# EAGLE design controlador (EAGLE 7.6.0)
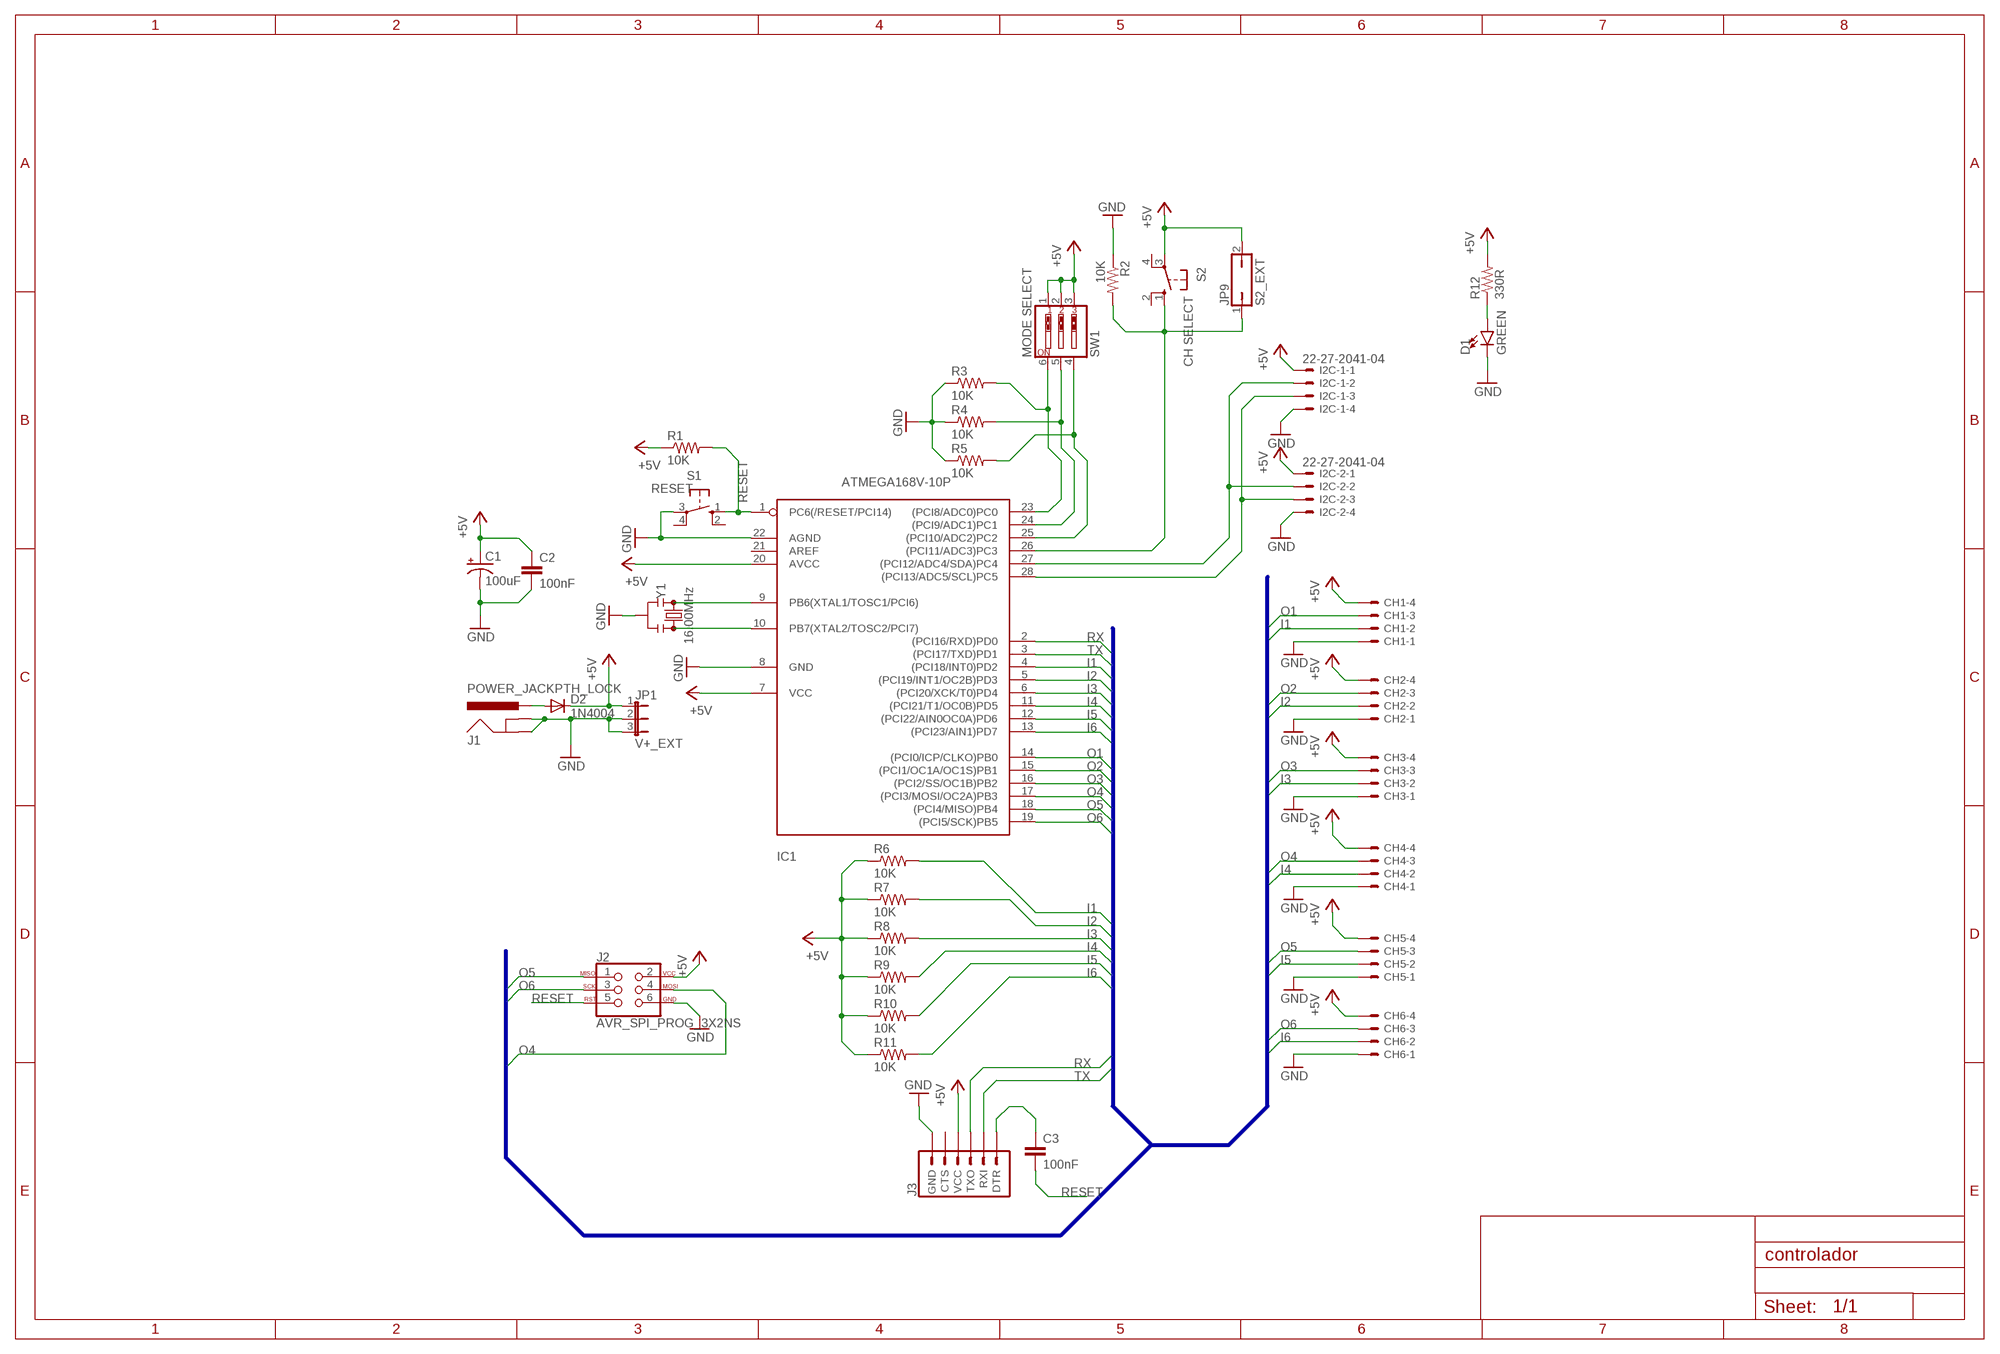
[diagram p0: schematic, sheet 1]

## Parts
C1  100uF  CPOL-USE2.5-7  [E2,5-7]
C2  100nF  C-EU075-032X103  [C075-032X103]
C3  100nF  C-EU075-032X103  [C075-032X103]
CH1  22-27-2041-04  [6410-04]
CH2  22-27-2041-04  [6410-04]
CH3  22-27-2041-04  [6410-04]
CH4  22-27-2041-04  [6410-04]
CH5  22-27-2041-04  [6410-04]
CH6  22-27-2041-04  [6410-04]
D1  GREEN  LED5MM  [LED_5MM]
D2  1N4004  [DO41-10]
I2C-1  22-27-2041-04  [6410-04]
I2C-2  22-27-2041-04  [6410-04]
IC1  ATMEGA168V-10P  [DIL28-3]
J1  POWER_JACKPTH_LOCK  [POWER_JACK_PTH_LOCK]
J2  AVR_SPI_PROG_3X2NS  [2X3-NS]
J3  6_PIN_SERIAL_TARGETSILK  [6_PIN_SERIAL_TARGET_SIDE_W_SILK]
JP1  V+_EXT  JP2E  [JP2]
JP9  S2_EXT  JP1Q  [JP1]
R1  10K  R-US_0204/7  [0204/7]
R2  10K  R-US_0204/7  [0204/7]
R3  10K  R-US_0204/7  [0204/7]
R4  10K  R-US_0204/7  [0204/7]
R5  10K  R-US_0204/7  [0204/7]
R6  10K  R-US_0204/7  [0204/7]
R7  10K  R-US_0204/7  [0204/7]
R8  10K  R-US_0204/7  [0204/7]
R9  10K  R-US_0204/7  [0204/7]
R10  10K  R-US_0204/7  [0204/7]
R11  10K  R-US_0204/7  [0204/7]
R12  330R  R-US_0204/7  [0204/7]
S1  RESET  10-XX  [B3F-10XX]
S2  CH SELECT  10-XX  [B3F-10XX]
SW1  MODE SELECT  SW_DIP-3  [EDG-03]
Y1  16.00MHz  RESONATORPTH-7.6X3.8  [RESONATOR-PTH-7.6X3.8]

## Nets
+5V [power]: C1.+ C2.1 CH1.4 CH2.4 CH3.4 CH4.4 CH5.4 CH6.4 D2.C I2C-1.1 I2C-2.1 IC1.7(VCC) IC1.20(AVCC) J2.2 J3.P$4(VCC) JP1.1 JP9.2 R1.1 R6.1 R7.1 R8.1 R9.1 R10.1 R11.1 R12.2 S2.3(P) SW1.1 SW1.2 SW1.3
GND: C1.- C2.2 CH1.1 CH2.1 CH3.1 CH4.1 CH5.1 CH6.1 D1.K(C) I2C-1.4 I2C-2.4 IC1.8(GND) IC1.22(AGND) J1.GND J1.GNDBREAK J2.6 J3.P$6(GND) JP1.2 JP1.3 R2.1 R3.1 R4.1 R5.1 S1.3(P) Y1.2
I1: CH1.2 IC1.4((PCI18/INT0)PD2) R6.2
I2: CH2.2 IC1.5((PCI19/INT1/OC2B)PD3) R7.2
I3: CH3.2 IC1.6((PCI20/XCK/T0)PD4) R8.2
I4: CH4.2 IC1.11((PCI21/T1/OC0B)PD5) R9.2
I5: CH5.2 IC1.12((PCI22/AIN0OC0A)PD6) R10.2
I6: CH6.2 IC1.13((PCI23/AIN1)PD7) R11.2
N$1: IC1.9(PB6(XTAL1/TOSC1/PCI6)) Y1.1
N$2: IC1.10(PB7(XTAL2/TOSC2/PCI7)) Y1.3
N$3: D1.A R12.1
N$4: I2C-1.2 I2C-2.2 IC1.27((PCI12/ADC4/SDA)PC4)
N$5: I2C-1.3 I2C-2.3 IC1.28((PCI13/ADC5/SCL)PC5)
N$6: IC1.26((PCI11/ADC3)PC3) JP9.1 R2.2 S2.1(S)
N$7: C3.1 J3.P$1(DTR)
N$8: D2.A J1.PWR
N$10: IC1.23((PCI8/ADC0)PC0) R3.2 SW1.6
N$11: IC1.24((PCI9/ADC1)PC1) R4.2 SW1.5
N$12: IC1.25((PCI10/ADC2)PC2) R5.2 SW1.4
O1: CH1.3 IC1.14((PCI0/ICP/CLKO)PB0)
O2: CH2.3 IC1.15((PCI1/OC1A/OC1S)PB1)
O3: CH3.3 IC1.16((PCI2/SS/OC1B)PB2)
O4: CH4.3 IC1.17((PCI3/MOSI/OC2A)PB3) J2.4
O5: CH5.3 IC1.18((PCI4/MISO)PB4) J2.1
O6: CH6.3 IC1.19((PCI5/SCK)PB5) J2.3
RESET: C3.2 IC1.1(PC6(/RESET/PCI14)) J2.5 R1.2 S1.1(S)
RX: IC1.2((PCI16/RXD)PD0) J3.P$2(TXO)
TX: IC1.3((PCI17/TXD)PD1) J3.P$3(RXI)
Unconnected: IC1.21(AREF) J3.P$5(CTS) S1.2(S1) S1.4(P1) S2.2(S1) S2.4(P1)

## Buses
B$1

## Library data of the parts
C1 = rcl:CPOL-US: POLARIZED CAPACITOR, American symbol
C2 C3 = rcl:C-EU: CAPACITOR, European symbol
CH1-CH6 I2C-1 I2C-2 = con-molex:22-?-04: CONNECTOR wire to board 2.54 mm (.1 inch) pitch header; OC_FARNELL: unknown; OC_NEWARK: unknown
D1 = SparkFun-LED:LED: LED (Generic) Standard schematic elements and footprints for 5mm, 3mm, 1206, and 0603 sized LEDs. Generic LEDs with no color specified.
D2 = diode:1N4004: DIODE general purpose rectifier, 1 A
IC1 = adafruit:ATMEGA168*P: MICROCONTROLLER 16 kBytes FLASH 1 kBytes SRAM 512 Bytes EEPROM USART 8-channel 10 bit ADC
J1 = SparkFun-Connectors:POWER_JACK: Power Jack Connector This is the standard 5.5mm barrel jack for power. The PTH is the most common, proven, reliable, footprint. The Slot footprint only works if the mill layer is transmitted to the PCB fab house so be warned. Here are the connectors we sell at SparkFun: DC Barrel Power Jack/Connector <https://www.sparkfun.com/products/119> (PRT-00119) DC Barrel Power Jack/Connector (SMD) <https://www.sparkfun.com/products/12748> (PRT-12748) DC Barrel Jack Adapter - Breadboard Compatible <https://www.sparkfun.com/products/10811> (PRT-10811) It is used on this SparkFun product (and many, many others): SparkFun RedBoard - Programmed with Arduino <https://www.sparkfun.com/products/12757> (DEV-12757) Also, if you need a mating power supply or connector, please check these out: Wall Adapter Power Supply - 9VDC 650mA <https://www.sparkfun.com/products/298> (TOL-00298) DC Barrel Jack Adapter - Male <https://www.sparkfun.com/products/10287> (PRT-10287); PROD_ID: CONN-08197; SF_ID: PRT-00119
J2 = SparkFun-Connectors:AVR_SPI_PROG_3X2: AVR ISP 6 Pin This is the reduced ISP connector for AVR programming. Common on Arduino. This footprint will take up less PCB space and can be used with a 10-pin to 6-pin adapter such as SKU: BOB-08508 **Special note about "TEST_POINT" package. The stop mask is on the top side, so if you want your programming test points to be on the bottom of your board, make sure to place this package on the bottom side of the board. This also ensure that the orientation to program from the bottom side will be correct. SparkFun Products: SparkFun ISP Pogo Adapter <https://www.sparkfun.com/products/11591> - NS Tiny AVR Programmer <https://www.sparkfun.com/products/11801> -PTH
J3 = SparkFun-Connectors:6_PIN_SERIAL_TARGET: 6-pin header connection for use with the "FTDI BASIC" pinout - TARGET SIDE. Also known as "Arduino Serial Program Header". It is used to mate with our FTDI Basic serial programmers using the Arduino IDE. Note, this device has "TARGET" in the name. It is intended to be used on a design that contains a target micro-controller that you wish to program. The "sister" device, named "CABLE" is inteneded to be used on a design that usually lives on the end of your USB cable and prvides the converter chip (FTDI232 or FTDI231x) to commnicate serial RX/TX. You can populate with some of these: Break Away Headers - Straight <https://www.sparkfun.com/products/116> (PRT-00116) For reference (or to suit your programming needs) check out these designs: SparkFun FTDI Basic Breakout - 5V <https://www.sparkfun.com/products/9716> (DEV-09716) SparkFun FTDI Basic Breakout - 3.3V <https://www.sparkfun.com/products/9873> (DEV-09873) SparkFun FTDI SmartBasic <https://www.sparkfun.com/products/12935> (DEV-12935) SparkFun Beefy 3 - FTDI Basic Breakout <https://www.sparkfun.com/products/13746> (DEV-13746)
JP1 = jumper:JP2E: JUMPER
JP9 = jumper:JP1Q: JUMPER
R1-R11 = rcl:R-US_: RESISTOR, American symbol
R12 = resistor:R-US_: RESISTOR, American symbol
S1 S2 = switch-omron:10-XX: OMRON SWITCH; MPN: B3F-1000; OC_FARNELL: 176432; OC_NEWARK: 36M3542
SW1 = special:SW_DIP-3: DIP SWITCH
Y1 = SparkFun-Clocks:RESONATOR: Resonators (Generic) Ceramic resonators are clock-generating components, often used to control timing in microcontrollers. They usually have 3 pins: two pins for oscillation, and one pin for ground. Compared to crystals, resonators have worse tolerance, but are usually much cheaper. Plus, they have built-in load capacitors! These devices are used on boards like the Arduino Pro 8MHz <https://www.sparkfun.com/products/11114> and Arduino Pro 16MHz <https://www.sparkfun.com/products/11113>.

## Net classes
0 default: width 0.5 mm
1 power: width 0.65 mm

## Board
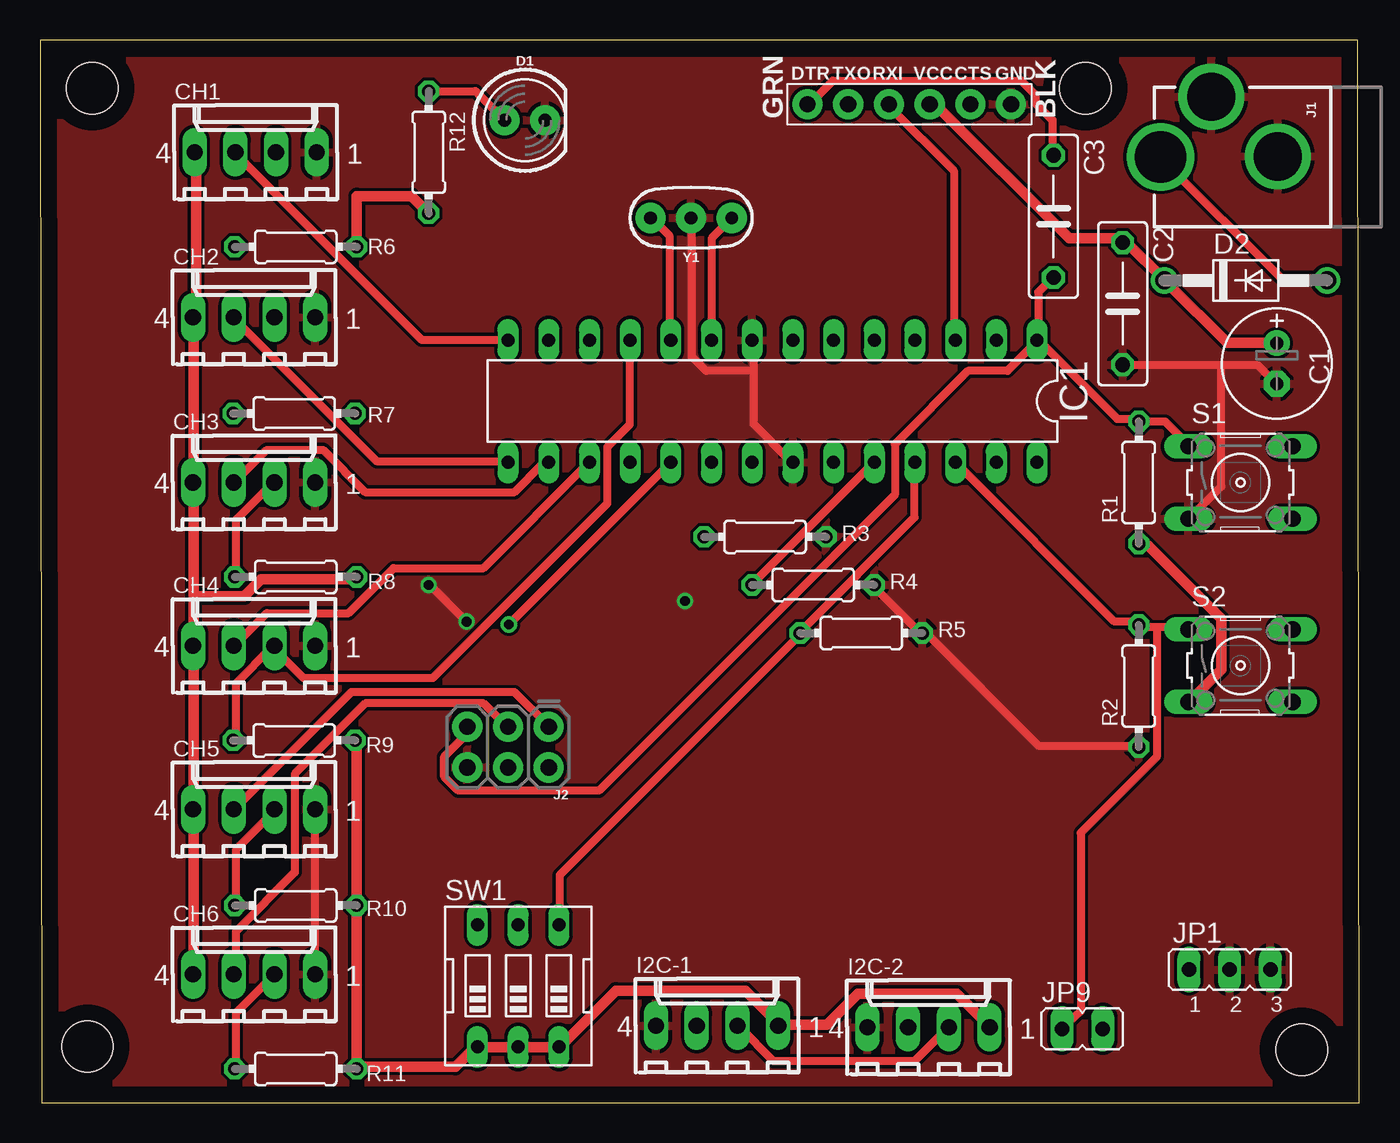
[diagram p1: board, top side]
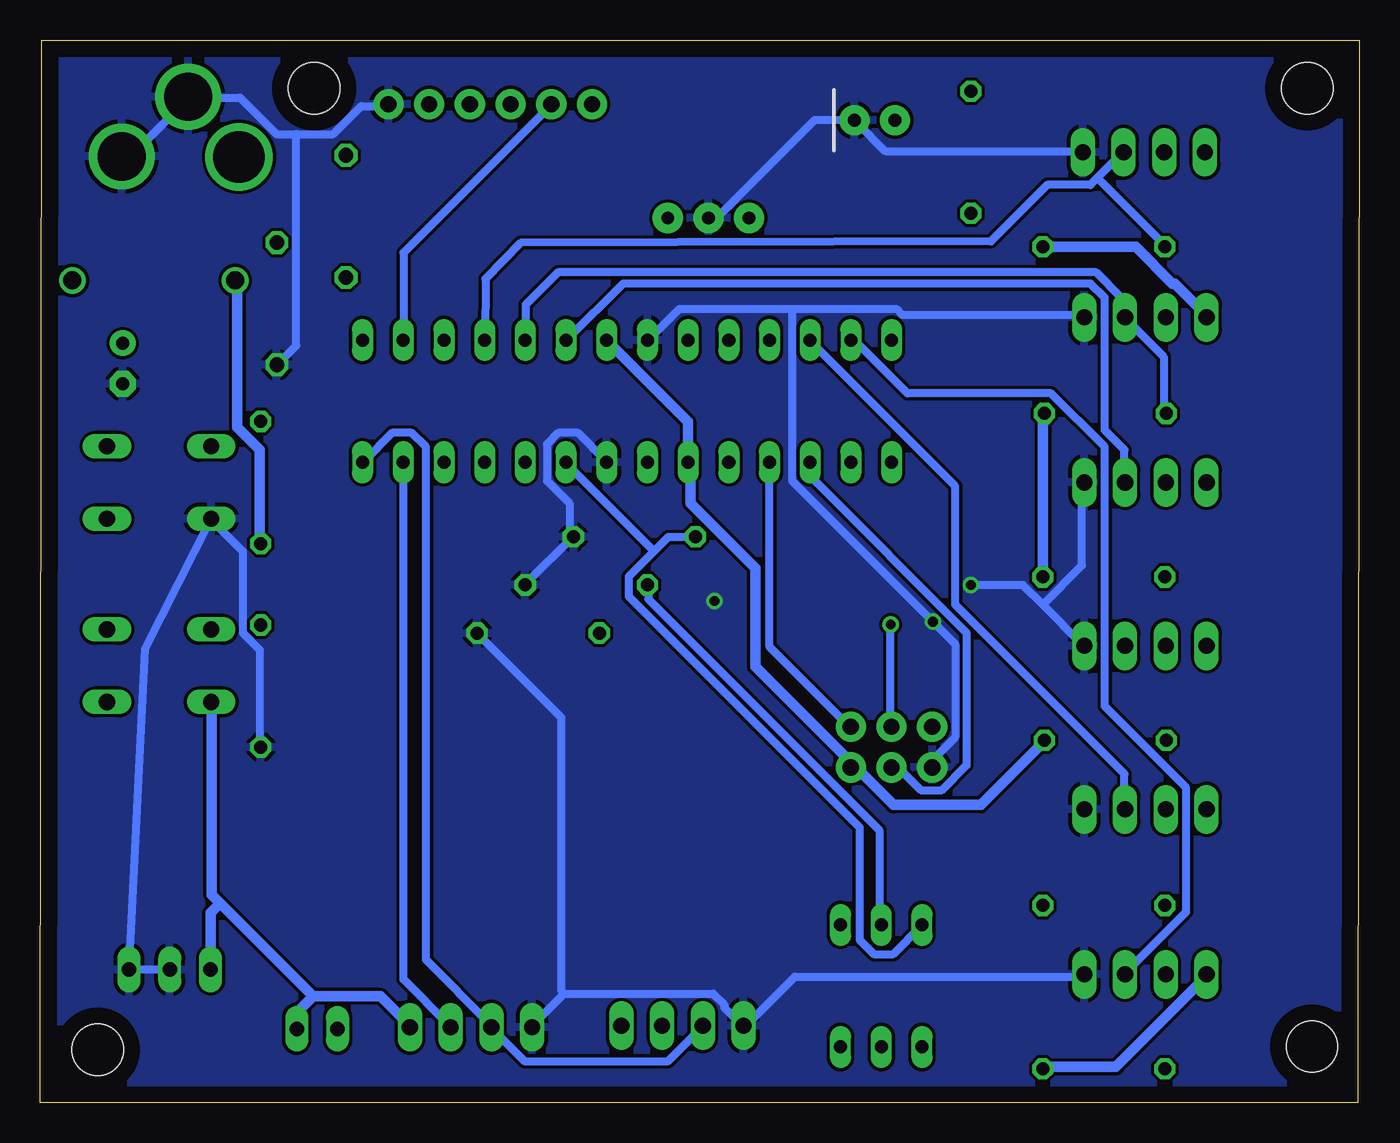
[diagram p2: board, bottom side, seen from below]

Size 82.36 x 66.3 mm. Coordinates in mm from the lower left corner, seen from the top.
Outline: 0.1,0 82.36,0 82.26,66.3 0,66.3 0.1,0
Copper layers (1*16): Top 0.035mm / dielectric 1.5mm / Bottom 0.035mm
Design rules "default": minimum track width 10mil, minimum drill 24mil, track to track 8mil, track to pad 8mil, pad to pad 8mil, via to via 8mil, smd to smd 8mil, copper to edge 40mil, drill to drill 8mil, minimum pad ring 10mil, minimum via ring 8mil, stop-mask expansion 4mil, vias tented up to drill 0mil, thermal gap 10mil
Holes 3.2 mm at 3.26,63.3 65.26,63.3 2.96,3.5 78.76,3.3

### Footprints (pad centres in the part's own frame; a part is rotated, then mirrored left to right if it is on the bottom)
E2,5-7 = drill 0.813 pad 1.6: + -1.27,0 | drill 0.813 pad 1.6 octagon: - 1.27,0
C075-032X103 = drill 0.914 octagon: 1 -3.81,0; 2 3.81,0
6410-04 = drill 1.016 long: 1 3.81,0; 2 1.27,0; 3 -1.27,0; 4 -3.81,0
LED_5MM = drill 0.813 pad 1.88: A -1.27,0; K 1.27,0
DO41-10 = drill 1.118: A 5.08,0; C -5.08,0
DIL28-3 = drill 0.813 long: 1 -16.51,-3.81; 2 -13.97,-3.81; 3 -11.43,-3.81; 4 -8.89,-3.81; 5 -6.35,-3.81; 6 -3.81,-3.81; 7 -1.27,-3.81; 8 1.27,-3.81; 9 3.81,-3.81; 10 6.35,-3.81; 11 8.89,-3.81; 12 11.43,-3.81; 13 13.97,-3.81; 14 16.51,-3.81; 15 16.51,3.81; 16 13.97,3.81; 17 11.43,3.81; 18 8.89,3.81; 19 6.35,3.81; 20 3.81,3.81; 21 1.27,3.81; 22 -1.27,3.81; 23 -3.81,3.81; 24 -6.35,3.81; 25 -8.89,3.81; 26 -11.43,3.81; 27 -13.97,3.81; 28 -16.51,3.81
POWER_JACK_PTH_LOCK = drill 2.997 pad 4.115: GND 0.025,6.557; GNDBREAK 3.762,10.7 | drill 3.2 pad 4.115: PWR 0,13.878
2X3-NS = drill 1.016 pad 1.88: 1 -2.54,-1.27; 2 -2.54,1.27; 3 0,-1.27; 4 0,1.27; 5 2.54,-1.27; 6 2.54,1.27
6_PIN_SERIAL_TARGET_SIDE_W_SILK = drill 1.016 pad 1.88: P$1 -6.35,0; P$2 -3.81,0; P$3 -1.27,0; P$4 1.27,0; P$5 3.81,0; P$6 6.35,0
JP2 = drill 0.914 long: 1 -2.54,0; 2 0,0; 3 2.54,0
JP1 = drill 0.914 long: 1 0,-1.27; 2 0,1.27
0204/7 = drill 0.813 octagon: 1 -3.81,0; 2 3.81,0
B3F-10XX = drill 1.016 long: 1 -3.251,2.261; 2 3.251,2.261; 3 -3.251,-2.261; 4 3.251,-2.261
EDG-03 = drill 0.813 long: 1 -2.54,-3.81; 2 0,-3.81; 3 2.54,-3.81; 4 2.54,3.81; 5 0,3.81; 6 -2.54,3.81
RESONATOR-PTH-7.6X3.8 = drill 0.8 pad 1.88: 1 -2.54,0; 2 0,0; 3 2.54,0

### Placement (x,y rotation side)
C1  77.2,46.12 270 top
C2  67.58,49.85 270 top
C3  63.26,55.3 270 top
CH1  13.46,59.3 0 top
CH2  13.36,49 0 top
CH3  13.36,38.7 0 top
CH4  13.36,28.5 0 top
CH5  13.36,18.3 0 top
CH6  13.36,8 0 top
D1  30.26,61.3 0 top
D2  75.26,51.3 0 top
I2C-1  42.26,4.8 0 top
I2C-2  55.46,4.7 0 top
IC1  45.72,43.77 180 top
J1  83.82,59.01 90 top
J2  29.21,22.18 180 top
J3  54.26,62.3 0 top
JP1  74.26,8.3 0 top
JP9  65.06,4.6 270 top
R1  68.58,38.69 90 top
R2  68.58,25.99 90 top
R3  45.26,35.3 180 top
R4  48.26,32.3 180 top
R5  51.26,29.3 180 top
R6  15.96,53.4 180 top
R7  15.86,43 180 top
R8  15.96,32.8 180 top
R9  15.86,22.6 180 top
R10  15.96,12.3 180 top
R11  15.96,2.1 180 top
R12  24.26,59.3 270 top
S1  74.93,38.69 0 top
S2  74.93,27.26 0 top
SW1  29.85,7.28 0 top
Y1  40.64,55.2 180 top

### Tracks (layer width: path | path; a pad name or v marks a point on that pad's centre or on a via)
+5V
  Top 0.65: 45.97,5.03 I2C-1.1 | R6.1 19.77,53.57 19.77,56.56 23.19,56.56 R12.2 | CH6.4 9.58,8.04 9.58,18.23 CH5.4 9.58,18.58 9.58,28.43 CH4.4 9.58,28.78 9.58,31.59 | 9.58,31.59 9.58,38.62 CH3.4 9.58,38.98 9.58,49 CH2.4 9.75,49.17 9.75,59.19 CH1.4 | 9.58,31.59 12.74,31.59 13.8,32.65 19.6,32.65 R8.1 | R1.1 68.65,34.76 69.17,34.76 73.74,30.19 73.74,27.02 71.81,25.09 S2.3 | C1.+ 77.09,47.41 74.1,47.41 70.4,51.11 D2.C 70.05,51.46 67.94,53.57 67.59,53.57 C2.1 67.42,53.92 64.25,53.92 55.99,62.18 55.64,62.18 J3.P$4 | I2C-1.1 46.32,4.87 49.13,4.87 51.07,6.8 57.22,6.8 59.15,4.87 I2C-2.1 | R9.1 19.77,22.45 19.77,12.61 R10.1 19.77,12.25 19.77,2.41 R11.1 19.77,2.23 25.93,2.23 27.16,3.46 SW1.1 27.51,3.46 29.62,3.46 SW1.2 29.97,3.46 32.26,3.46 SW1.3 32.61,3.64 35.95,6.98 44.03,6.98 45.79,5.22 I2C-1.1
  Bottom 0.65: R8.1 19.77,32.82 19.77,42.84 R7.1 | R6.1 19.6,53.39 13.97,53.39 11.69,51.11 11.51,51.11 9.58,49.17 CH2.4 | R1.1 68.65,34.93 68.65,40.73 70.05,42.14 70.05,51.28 D2.C | 65.31,6.63 66.24,5.69 JP9.2 | 65.31,6.63 61.09,6.63 59.33,4.87 I2C-2.1 | IC1.7 46.85,47.41 41.92,42.49 41.92,40.03 IC1.20 41.75,39.68 41.75,37.39 37.7,33.35 37.7,27.2 31.73,21.22 J2.2 31.73,20.87 31.38,20.87 29.09,18.58 23.64,18.58 19.77,22.45 R9.1 | 65.31,6.63 71.12,12.44 | 71.12,12.44 71.64,12.96 71.64,24.91 S2.3 | CH6.4 9.58,7.86 15.2,2.23 19.6,2.23 R11.1 | JP1.1 71.72,11.84 71.12,12.44
GND  (via drill 0.61)
  Top 0.5: 52.12,32.27 R4.1 52.12,32.12 54.76,29.48 R5.1 | 54.93,29.46 R5.1 | 73.74,46.01 76.03,46.01 77.09,44.95 C1.- | 73.74,46.01 67.59,46.01 C2.2 | 73.74,46.01 73.74,38.45 71.81,36.52 S1.3 | CH6.1 17.14,8.04 17.14,18.23 CH5.1 | 44.56,45.66 44.56,42.32 46.85,40.03 IC1.22 | 44.56,45.66 44.56,47.41 IC1.8 | v26.63,30.01 24.35,32.3 v24.26,32.3 | 44.56,45.66 41.57,45.66 40.69,46.53 40.69,55.15 Y1.2 | R2.1 68.47,22.28 62.32,22.28 55.28,29.31 R5.1
  Bottom 0.5: 66.36,60.42 67.59,60.42 69.88,62.71 73.04,62.71 J1.GNDBREAK 73.22,62.53 76.56,59.19 77.26,59.19 J1.GND | 66.36,60.42 64.08,60.42 62.32,62.18 60.73,62.18 J3.P$6 | R2.1 68.65,22.28 68.65,28.25 69.7,29.31 69.7,34.4 71.64,36.34 S1.3 75.8,28.31 JP1.3 JP1.2 | 66.36,60.42 66.36,47.24 67.42,46.18 C2.2 | 49.66,6.8 40.34,6.8 39.64,6.1 39.64,5.93 38.58,4.87 I2C-1.4 38.23,4.87 35.24,7.86 17.31,7.86 CH6.1 | 49.66,6.8 51.59,4.87 I2C-2.4 | CH1.1 17.31,59.37 29.62,59.37 31.38,61.13 D1.K 31.73,61.3 34.01,61.3 39.99,55.32 40.52,55.32 Y1.2 | 19.77,31.07 17.31,28.6 CH4.1 | 19.77,31.07 21,32.3 24.17,32.3 v24.26,32.3 | 19.77,31.07 17.31,33.53 17.31,38.62 CH3.1 | R4.1 51.95,32.47 49.13,35.28 R3.1 49.31,35.46 49.31,37.39 50.71,38.8 50.71,41.09 50.01,41.79 48.78,41.79 47.02,40.03 IC1.22 | 35.42,49.52 42.45,49.52 44.39,47.59 IC1.8 | 35.42,49.52 28.92,49.52 28.56,49.17 17.31,49.17 CH2.1 | 35.42,49.52 35.42,38.8 v26.63,30.01 25.22,28.6 25.22,22.8 26.63,21.4 26.63,21.04 J2.6 | 49.66,6.8 49.84,6.98 49.84,24.03 54.93,29.13 R5.1
  other vias: 40.26,31.3
  pour Top: 1.26,65.3 81.26,65.3 81.26,0.3 1.26,0.3
  pour Bottom: 1.26,65.3 81.26,65.3 81.26,0.3 1.26,0.3
I1
  Bottom 0.5: 16.35,57.7 14.85,59.19 CH1.2 | 16.35,57.7 16.79,57.26 19.49,57.26 23,53.74 52.36,53.64 54.56,51.4 54.58,47.59 IC1.4 | 16.35,57.7 12.21,53.57 R6.2
I2
  Bottom 0.5: R7.2 12.21,43.02 12.21,46.53 14.68,49 CH2.2 14.85,49.17 14.85,50.23 16.43,51.81 50.03,51.81 52.04,49.79 IC1.5
I3
  Top 0.5: R8.2 12.21,32.82 12.21,36.34 14.5,38.62 CH3.2
  Bottom 0.5: IC1.6 49.48,47.59 45.97,51.11 16.79,51.11 15.91,50.23 15.91,41.96 14.68,40.73 14.68,38.8 CH3.2
I4
  Top 0.5: R9.2 12.21,22.63 12.21,26.14 14.5,28.43 CH4.2 14.68,28.25 16.43,26.49 24.52,26.49 35.42,37.39 35.42,40.91 36.83,42.32 36.83,47.41 IC1.11
I5
  Top 0.5: R10.2 12.21,12.43 12.21,15.77 14.68,18.23 CH5.2
  Bottom 0.5: IC1.12 34.19,47.41 25.22,38.45 25.22,31.07 14.68,20.52 14.68,18.41 CH5.2
I6
  Top 0.5: R11.2 12.21,2.23 12.21,5.57 14.5,7.86 CH6.2
  Bottom 0.5: IC1.13 31.73,47.41 31.38,47.41 28.21,44.25 19.25,44.25 15.91,40.91 15.91,24.74 10.81,19.64 10.81,11.9 14.68,8.04 CH6.2
N$1
  Top 0.5: IC1.9 41.92,47.59 41.92,53.92 43.16,55.15 Y1.1
N$2
  Top 0.5: IC1.10 39.29,47.59 39.29,54.09 38.23,55.15 Y1.3
N$3
  Top 0.5: R12.1 27.18,63.11 D1.A
N$4
  Top 0.5: I2C-1.2 43.68,4.69 45.79,2.58 54.58,2.58 56.69,4.69 I2C-2.2
  Bottom 0.5: IC1.27 59.68,39.85 59.68,7.68 56.87,4.87 I2C-2.2
N$5
  Bottom 0.5: IC1.28 62.14,40.03 60.38,41.79 59.15,41.79 58.27,40.91 58.27,8.91 54.23,4.87 I2C-2.3 54.05,4.52 52.12,2.58 43.16,2.58 41.05,4.69 I2C-1.3
N$6
  Top 0.5: 69.7,29.66 71.64,29.66 S2.1 | 69.7,29.66 68.65,29.66 R2.2 68.47,30.01 67.06,30.01 57.22,39.85 IC1.26 | 69.7,29.66 69.7,21.57 64.95,16.82 64.95,5.69 JP9.1
N$7
  Top 0.5: C3.1 63.2,59.19 63.2,61.3 62.14,62.36 62.14,62.88 61.26,63.76 49.48,63.76 48.08,62.36 J3.P$1
N$8
  Top 0.5: D2.A 80.25,51.46 77.44,51.46 70.05,58.84 J1.PWR
N$10
  Bottom 0.5: 44.03,34.4 43.16,35.28 41.57,35.28 R3.2 | 44.03,34.4 45.62,32.82 45.62,31.59 31.2,17.18 31.2,10.15 30.32,9.27 29.09,9.27 27.33,11.02 SW1.6 | 44.03,34.4 49.48,39.85 IC1.23
N$11
  Top 0.5: IC1.24 51.95,39.85 44.56,32.47 R4.2
  Bottom 0.5: SW1.5 29.97,11.2 29.97,17 44.39,31.42 44.39,32.3 R4.2
N$12
  Top 0.5: SW1.4 32.43,11.2 32.43,14.19 47.37,29.13 R5.2 47.55,29.48 54.58,36.52 54.58,39.85 IC1.25
O1
  Top 0.5: IC1.14 29.09,47.59 23.82,47.59 12.21,59.19 CH1.3
O2
  Top 0.5: IC1.15 29.09,40.03 21,40.03 12.04,49 CH2.3
O3
  Top 0.5: IC1.16 31.73,39.85 31.38,39.85 29.62,38.1 20.3,38.1 17.66,40.73 14.15,40.73 12.21,38.8 CH3.3
O4
  Top 0.5: IC1.17 34.19,39.85 27.69,33.35 22.06,33.35 19.25,30.54 14.15,30.54 12.21,28.6 CH4.3
  Bottom 0.5: J2.4 29.09,20.87 28.74,20.87 27.33,19.46 26.1,19.46 24.52,21.04 24.52,29.31 34.19,38.98 34.19,39.85 IC1.17
O5
  Top 0.5: CH5.3 12.21,18.41 19.42,25.62 29.62,25.62 31.73,23.51 J2.1
  Bottom 0.5: IC1.18 36.83,39.85 36.83,28.43 31.9,23.51 J2.1
O6  (via drill 0.61)
  Top 0.5: v29.27,29.83 39.29,39.85 IC1.19 | CH6.3 12.21,8.04 12.21,10.67 15.91,14.36 15.91,20.52 20.3,24.91 27.69,24.91 29.09,23.51 J2.3
  Bottom 0.5: v29.27,29.83 29.27,23.51 J2.3
RESET
  Top 0.5: S1.1 71.64,41.09 70.23,42.49 68.65,42.49 R1.2 68.47,42.67 67.24,42.67 62.49,47.41 IC1.1 | IC1.1 62.32,47.59 62.32,50.58 63.2,51.46 C3.2 | J2.5 26.63,23.33 26.63,22.98 25.22,21.57 25.22,20.34 26.1,19.46 34.89,19.46 53.35,37.92 53.35,41.09 57.92,45.66 60.38,45.66 62.14,47.41 IC1.1
RX
  Bottom 0.5: IC1.2 59.68,53.04 50.54,62.18 J3.P$2
TX
  Top 0.5: IC1.3 57.04,47.59 57.04,58.14 53,62.18 J3.P$3